# EAGLE schematic plugshield (EAGLE 7.4.0)
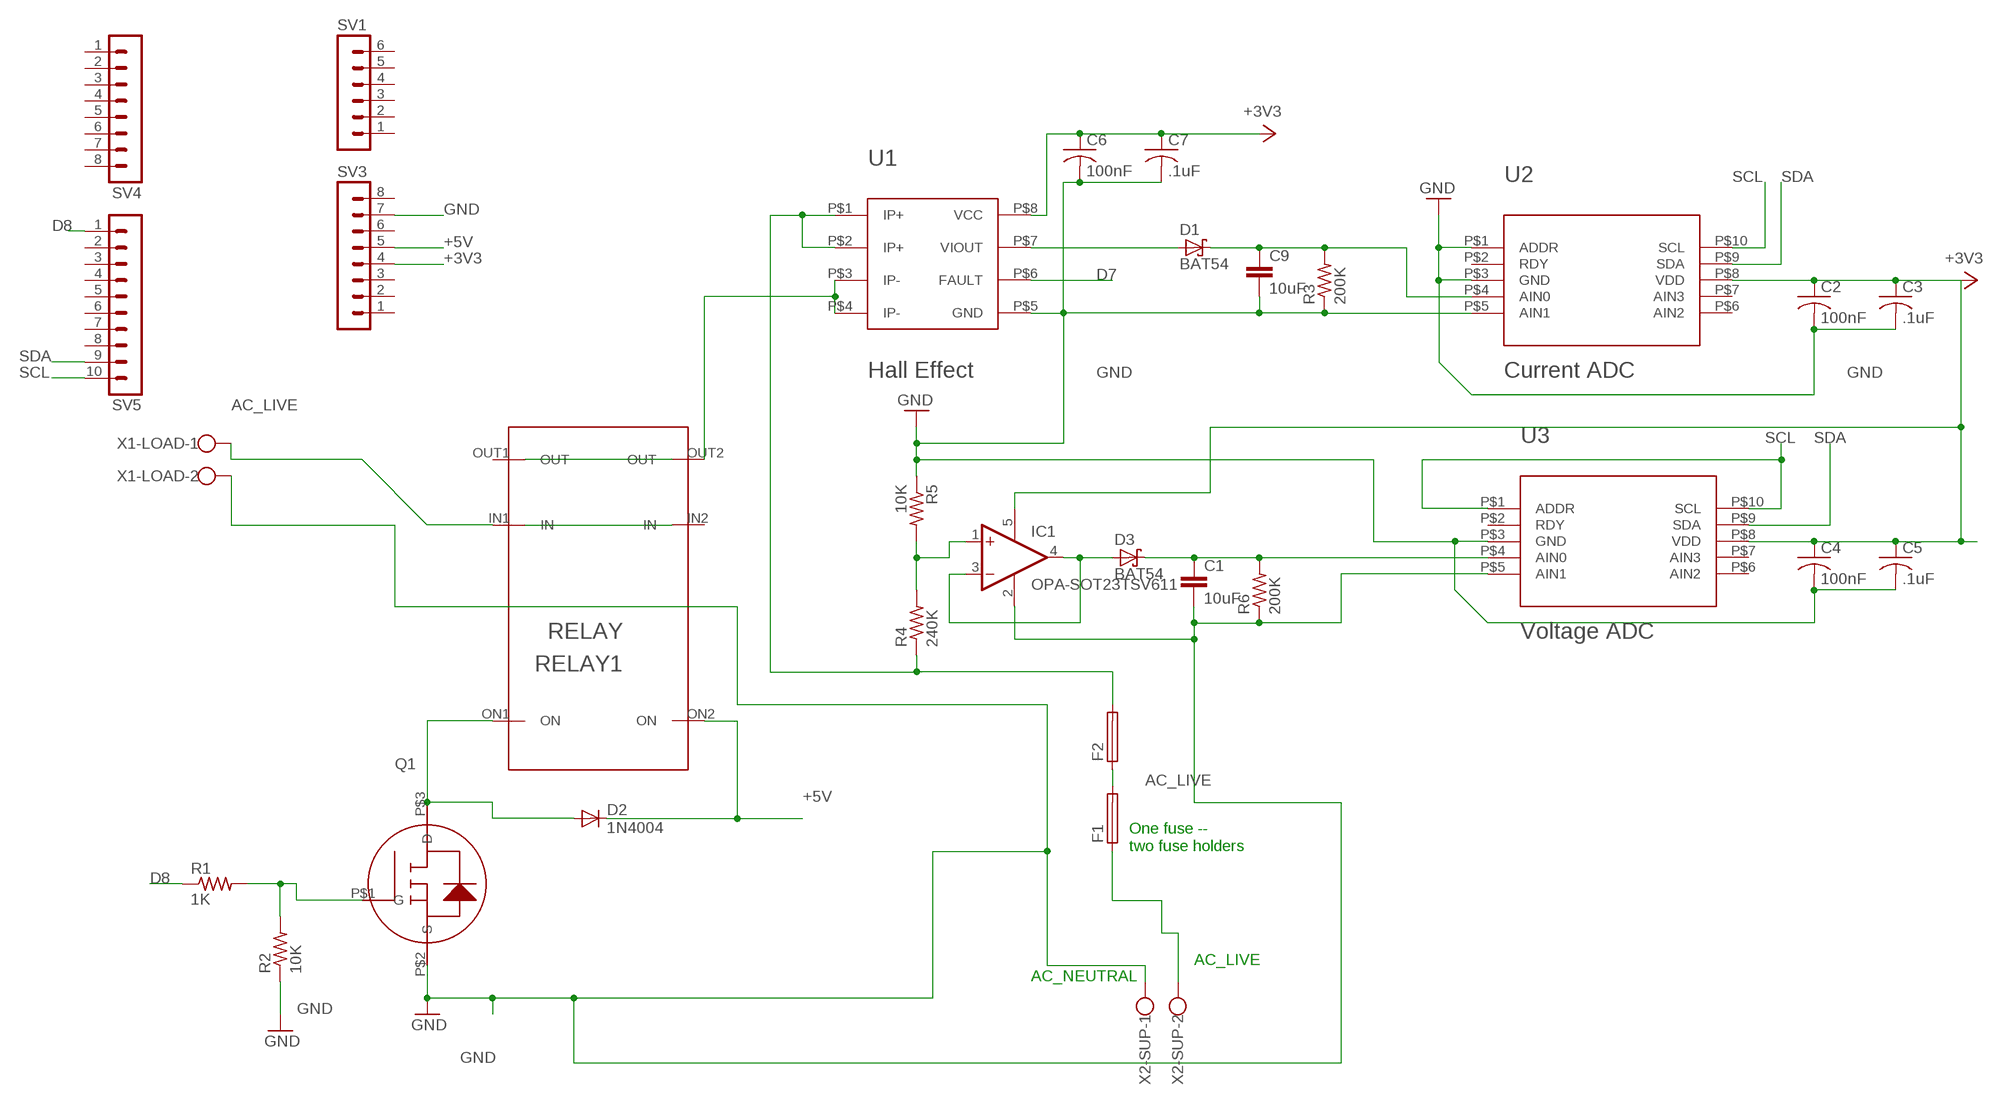
[diagram p0: schematic, sheet 1]

## Parts
C1  10uF  C-EUC0805  [C0805]
C2  100nF  C-USC1206  [C1206]
C3  .1uF  C-USC1206  [C1206]
C4  100nF  C-USC1206  [C1206]
C5  .1uF  C-USC1206  [C1206]
C6  100nF  C-USC1206  [C1206]
C7  .1uF  C-USC1206  [C1206]
C9  10uF  C-EUC0805  [C0805]
D1  BAT54  [SOT23]
D2  1N4004  [DO41-10]
D3  BAT54  [SOT23]
F1  19560  [19560]
F2  19560  [19560]
IC1  OPA-SOT23TSV611  [SOT23-5]
Q1  BSH105  [SOT23]
R1  1K  R-US_CT14J  [0411/15]
R2  10K  R-US_CT14J  [0411/15]
R3  200K  R-US_CT14J  [0411/15]
R4  240K  R-US_0411/15  [0411/15]
R5  10K  R-US_0411/15  [0411/15]
R6  200K  R-US_CT14J  [0411/15]
RELAY1  RELAY  G5RL-1A-E-HR  [G5RL-1A-E-HR]
SV1  MA06-1  [MA06-1]
SV3  MA08-1  [MA08-1]
SV4  MA08-1  [MA08-1]
SV5  MA10-1  [MA10-1]
U1  Hall Effect  ACS711LC  [ACS711]
U2  Current ADC  ADS1013IDGST  [ADS1013]
U3  Voltage ADC  ADS1013IDGST  [ADS1013]
X1-LOAD  W237-102  [W237-102]
X2-SUP  W237-102  [W237-102]

## Nets
+3V3: C2.1 C3.1 C4.1 C5.1 C6.1 C7.1 IC1.5(V+) SV3.4 U1.P$8(VCC) U2.P$8(VDD) U3.P$8(VDD)
+5V: D2.C RELAY1.ON2(ON) SV3.5
AC_LIVE [analoghot]: F1.1 F1.2 F2.1 F2.2 R4.1 RELAY1.IN1(IN) RELAY1.OUT2(OUT) U1.P$1(IP+) U1.P$2(IP+) U1.P$3(IP-) U1.P$4(IP-) X1-LOAD.1 X2-SUP.2
D7: U1.P$6(FAULT)
D8: R1.1 SV5.1
GND: C1.2 C2.2 C3.2 C4.2 C5.2 C6.2 C7.2 C9.2 IC1.2(V-) Q1.P$2(S) R2.1 R3.1 R5.1 R6.1 SV3.7 U1.P$5(GND) U2.P$1(ADDR) U2.P$3(GND) U2.P$5(AIN1) U3.P$3(GND) U3.P$5(AIN1) X1-LOAD.2 X2-SUP.1
N$4: D2.A Q1.P$3(D) RELAY1.ON1(ON)
N$5: C9.1 D1.3(C) R3.2 U2.P$4(AIN0)
N$6: Q1.P$1(G) R1.2 R2.2
N$7: D1.1(A) U1.P$7(VIOUT)
N$15: C1.1 D3.3(C) R6.2 U3.P$4(AIN0)
N$17: D3.1(A) IC1.3(-IN) IC1.4(OUT)
N$31: IC1.1(+IN) R4.2 R5.2
SCL: SV5.10 U2.P$10(SCL) U3.P$1(ADDR) U3.P$10(SCL)
SDA: SV5.9 U2.P$9(SDA) U3.P$9(SDA)
Unconnected: RELAY1.IN2(IN) RELAY1.OUT1(OUT) SV1.1 SV1.2 SV1.3 SV1.4 SV1.5 SV1.6 SV3.1 SV3.2 SV3.3 SV3.6 SV3.8 SV4.1 SV4.2 SV4.3 SV4.4 SV4.5 SV4.6 SV4.7 SV4.8 SV5.2 SV5.3 SV5.4 SV5.5 SV5.6 SV5.7 SV5.8 U2.P$2(RDY) U2.P$6(AIN2) U2.P$7(AIN3) U3.P$2(RDY) U3.P$6(AIN2) U3.P$7(AIN3)

## Notes on the sheet
- One fuse -- 
  two fuse holders
- AC_LIVE
- AC_NEUTRAL

## Library data of the parts
C1 C9 = rcl:C-EU: CAPACITOR, European symbol
C2-C7 = rcl:C-US: CAPACITOR, American symbol
D1 D3 = diode:BAT54: Schottky Diodes Source: Fairchild .. BAT54.pdf
D2 = diode:1N4004: DIODE general purpose rectifier, 1 A
F1 F2 = fuse:19560: FUSE HOLDER TR5, Wickmann; MPN: 56000001009; OC_FARNELL: 1185363; OC_NEWARK: 15P8392
IC1 = linear:OPA*-SOT23: Single Operational Amplifier Low Power, Single-Supply, Rail-To-Rail Operational Amplifier Source: http://focus.ti.com/lit/ds/symlink/opa2345.pdf
Q1 = jackIdd:BSH105: IDD Custom Part
R1-R6 = jackIdd:R-US_: RESISTOR, American symbol
RELAY1 = iddproject:G5RL-1A-E-HR
SV1 = con-lstb:MA06-1: PIN HEADER; OC_FARNELL: unknown; OC_NEWARK: unknown
SV3 SV4 = con-lstb:MA08-1: PIN HEADER; OC_FARNELL: unknown; OC_NEWARK: unknown
SV5 = con-lstb:MA10-1: PIN HEADER; OC_FARNELL: unknown; OC_NEWARK: unknown
U1 = iddproject:ACS711LC: ACS711 Hall Effect Sensor http://www.digikey.com/product-detail/en/ACS711ELCTR-25AB-T/620-1371-1-ND/2470595
U2 U3 = iddproject:ADS1013IDGST: ADS1013 IDGST analog-digital converter http://www.ti.com/lit/ds/symlink/ads1013.pdf http://www.digikey.com/product-detail/en/ADS1013IDGST/296-25225-1-ND/2174995
X1-LOAD X2-SUP = con-wago-500:W237-102: WAGO SCREW CLAMP; MPN: 237-102; OC_FARNELL: unknown; OC_NEWARK: 70K9898

## Net classes
0 default: width 0.406 mm, clearance 0.305 mm
1 analoghot: width 4.597 mm, clearance 0.61 mm